# Altium schematic sheet STPedal_STM32.SchDoc
size A4; SheetNumber: 1; SheetTotal: 4
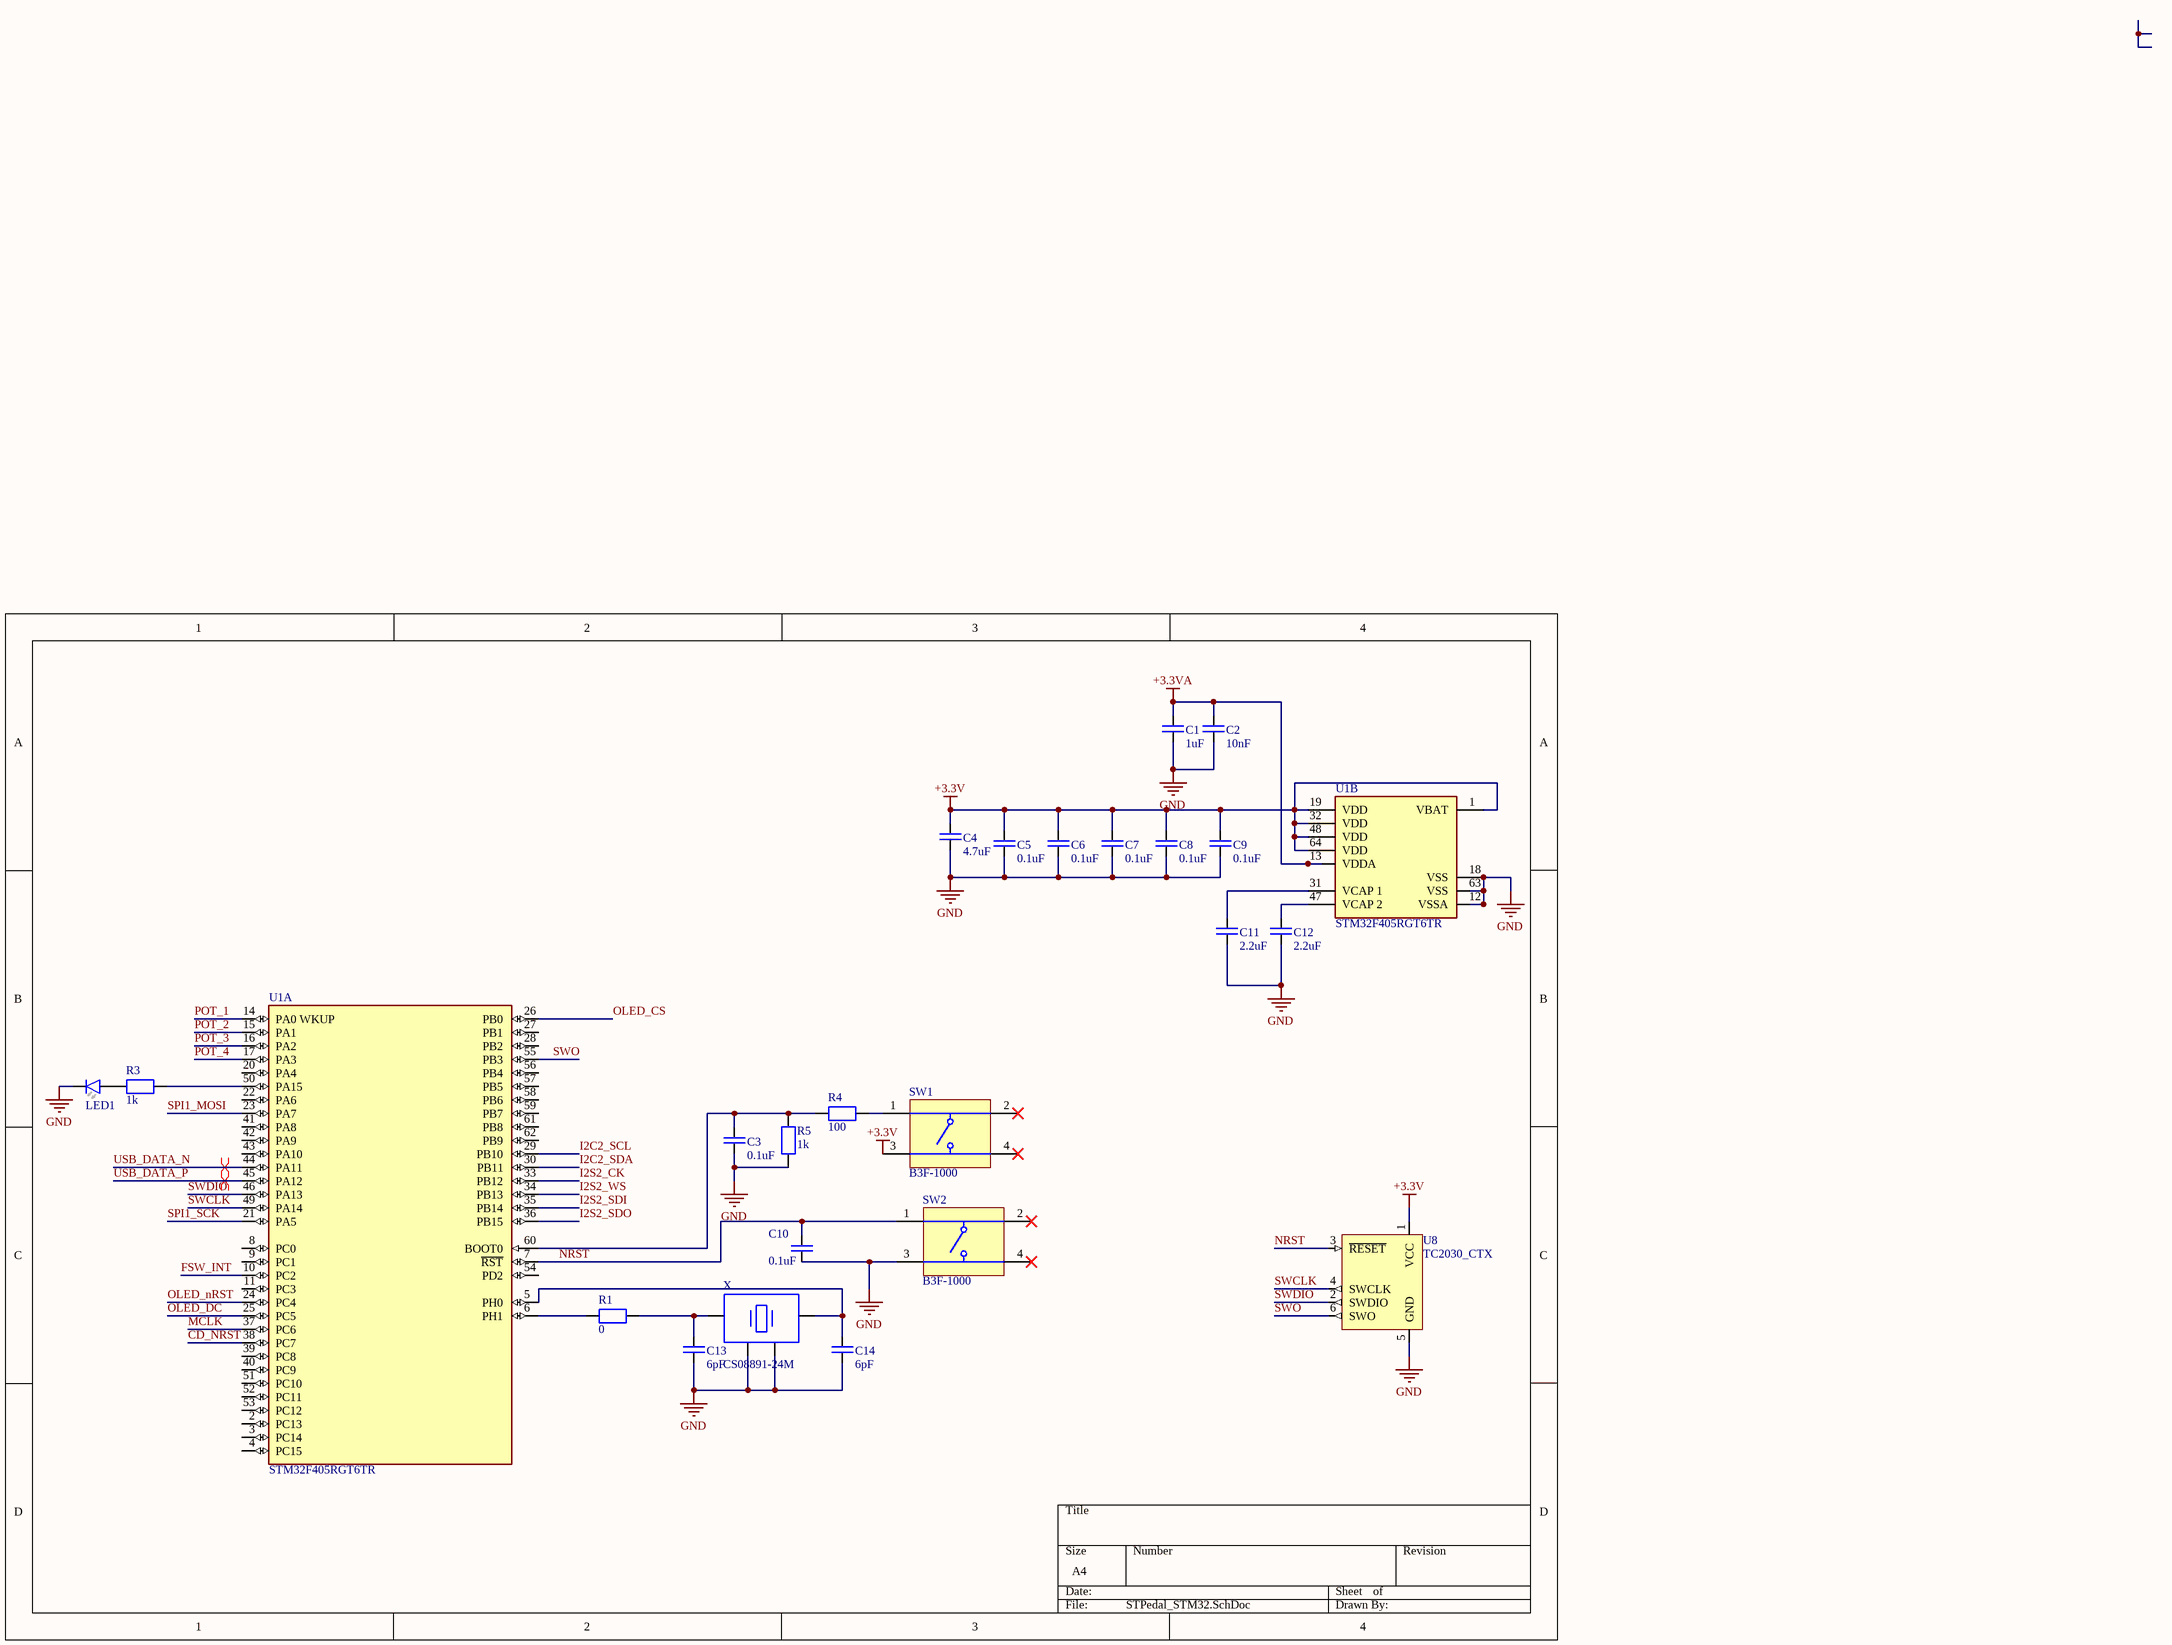
[diagram p0: STPedal_STM32.SchDoc]

## Parts
C1  1uF  [CAPC_0402_1005X55N]
C2  10nF  [CAPC_0402_1005X55N]
C3  0.1uF  [CAPC_0402_1005X55N]
C4  4.7uF  [CAPC_0402_1005X55N]
C5  0.1uF  [CAPC_0402_1005X55N]
C6  0.1uF  [CAPC_0402_1005X55N]
C7  0.1uF  [CAPC_0402_1005X55N]
C8  0.1uF  [CAPC_0402_1005X55N]
C9  0.1uF  [CAPC_0402_1005X55N]
C10  0.1uF  [CAPC_0402_1005X55N]
C11  2.2uF  [CAPC_0402_1005X55N]
C12  2.2uF  [CAPC_0402_1005X55N]
C13  6pF  [CAPC_0402_1005X55N]
C14  6pF  [CAPC_0402_1005X55N]
LED1  LED_White_JLCD_0603  [LED_0603_1608]  (value not drawn)
R1  0  [RESC_0402_1005X40N]
R3  1k  [RESC_0402_1005X40N]
R4  100  [RESC_0402_1005X40N]
R5  1k  [RESC_0402_1005X40N]
SW1  B3F-1000  [OMRON-B3F-1000-4_V]
SW2  B3F-1000  [OMRON-B3F-1000-4_V]
U1  STM32F405RGT6TR  [FP-LQFP64-5W-IPC_C]  (parts A,B of 2)
U8  TC2030_CTX  [TC2030_CTX]  (no BOM)
X  CS08891-24M  [4 SMD - No Lead]

## Nets
+3.3V: C4.2 C5.2 C6.2 C7.2 C8.2 C9.2 SW1.3 U1.1(VBAT) U1.19(VDD) U1.32(VDD) U1.48(VDD) U1.64(VDD) U8.1(VCC)
+3.3VA: C1.2 C2.2 U1.13(VDDA)
GND: C1.1 C2.1 C3.1 C4.1 C5.1 C6.1 C7.1 C8.1 C9.1 C10.1 C11.1 C12.1 C13.1 C14.1 LED1.2 R5.1 SW2.3 U1.12(VSSA) U1.18(VSS) U1.63(VSS) U8.5(GND) X.2 X.4
CD_NRST: U1.38(PC7)
FSW_INT: U1.10(PC2)
I2C2_SCL: U1.29(PB10)
I2C2_SDA: U1.30(PB11)
I2S2_CK: U1.33(PB12)
I2S2_SDI: U1.35(PB14)
I2S2_SDO: U1.36(PB15)
I2S2_WS: U1.34(PB13)
MCLK: U1.37(PC6)
NRST: C10.2 SW2.1 U1.7(~{RST}) U8.3(~{RESET})
OLED_CS: U1.26(PB0)
OLED_DC: U1.25(PC5)
OLED_nRST: U1.24(PC4)
POT_1: U1.14(PA0_WKUP)
POT_2: U1.15(PA1)
POT_3: U1.16(PA2)
POT_4: U1.17(PA3)
SPI1_MOSI: U1.23(PA7)
SPI1_SCK: U1.21(PA5)
SWCLK: U1.49(PA14) U8.4(SWCLK)
SWDIO: U1.46(PA13) U8.2(SWDIO)
SWO: U1.55(PB3) U8.6(SWO)
USB_DATA_N: U1.44(PA11)
USB_DATA_P: U1.45(PA12)
NetC3_2: C3.2 R4.1 R5.2 U1.60(BOOT0)
NetC11_2: C11.2 U1.31(VCAP_1)
NetC12_2: C12.2 U1.47(VCAP_2)
NetC13_2: C13.2 R1.2 X.1
NetC14_2: C14.2 U1.5(PH0) X.3
NetLED1_1: LED1.1 R3.1
NetR1_1: R1.1 U1.6(PH1)
NetR3_2: R3.2 U1.50(PA15)
NetR4_2: R4.2 SW1.1

Not connected (* = marked no-connect by the designer): SW1 2* 4*; SW2 2* 4*; U1 2(PC13) 3(PC14) 4(PC15) 8(PC0) 9(PC1) 11(PC3) 20(PA4) 22(PA6) 27(PB1) 28(PB2) 39(PC8) 40(PC9) 41(PA8) 42(PA9) 43(PA10) 51(PC10) 52(PC11) 53(PC12) 54(PD2) 56(PB4) 57(PB5) 58(PB6) 59(PB7) 61(PB8) 62(PB9)

## Layout directives
differential pair: USB_DATA_N, USB_DATA_P

## Library data of the parts
C1 = 1uF_CAP_0402: Capacitor 0402 - 1uF +-/10% / 25V; Manufacturer: Samsung Electro-Mechanics; MPN: CL05A105KA5NQNC; LCSC: C52923
C2 = 10nF_CAP_0402: Capacitor 0402 - 10nF +-/10% / 25V; Manufacturer: Samsung Electro-Mechanics; MPN: CL05B103KB5NNNC; LCSC: C15195
C3 C5-C10 = 0.1uF_CAP_0402: Capacitor 0402 - 0.1uF +-/10% / 16V; Manufacturer: Samsung Electro-Mechanics; MPN: CL05B104KO5NNNC; LCSC: C1525
C4 = 4.7uF_CAP_0402: Capacitor 0402 - 4.7uF +-/20% / 10V; Manufacturer: Samsung Electro-Mechanics; MPN: CL05A475MP5NRNC; LCSC: C23733
C11 C12 = 2.2uF_CAP_0402: Capacitor 0402 - 2.2uF +-/10% / 25V; Manufacturer: Samsung Electro-Mechanics; MPN: CL05A225MQ5NSNC; LCSC: C12530
C13 C14 = 6pF_CAP_0402: Capacitor 0402 - 6pF +-/10% / 50V - C0G; Manufacturer: FH (Guangdong Fenghua Advanced Tech); MPN: 0402CG6R0C500NT; LCSC: C1575
LED1 = LED_White_JLCD_0603: -40℃~+85℃ 100mW 120° 2.6V~3.1V 360mcd 5mA Discrete Diode Top-mount White Yellow Lens 0603 LED Indication - Discrete ROHS; Manufacturer: Hubei KENTO Elec; MPN: KT-0603W; LCSC: C2290
R1 = 0R_JLCRES-0402: -55℃~+155℃ 0Ω 50V 62.5mW Thick Film Resistor ±1% ±800ppm/℃ 0402 Chip Resistor - Surface Mount ROHS; Manufacturer: UNI-ROYAL(Uniroyal Elec); MPN: 0402WGF0000TCE; LCSC: C17168
R3 R5 = 1k_JLCRES-0402: Resistor 0402 - 1k; Manufacturer: UNI-ROYAL(Uniroyal Elec); MPN: 0402WGF1001TCE; LCSC: C11702
R4 = 100R_JLCRES-0402: Resistor 0402 - 100R; Manufacturer: *; MPN: *; LCSC: C25076
SW1 SW2 = CMP-011-00004-2: Tactile Switch, SPST-NO, 0.05 A, 24 V, -25 to 70 degC, 4-Pin THD, RoHS, Bulk; Manufacturer: Omron Electronic Components; Throw Configuration: SPST; Max Contact Resistance: 100mohm; Resistance: 0.1Ohm; Max Current Rating: 50mA; Voltage Rating: 24V; Operating Force: 100gf; Datasheet Version: Jan-15; Case/Package: B3F-1000; Packaging: Bulk; Package Description: 4-Pin Through Hole Device, Body 6 x 6 mm; Manufacturer URL: http://www.omron.com/; Package Reference: B3F-1000; Contact Plating: Gold; Contact Current Rating: 50mA; RoHS Compliant: True; Contact Material: Gold; Mounting Technology: TH; Max Operating Temperature: 70°C; Min Operating Temperature: -25°C; Package Quantity: 1500; Datasheet URL: http://www.omron.com/ecb/products/pdf/en-b3f.pdf; Voltage Rating (DC): 24V; Pins: 4; Current Rating: 50mA; Max Voltage Rating (DC): 24V
U1 = CMP-0243-00156-2: IC MCU 32BIT 1MB FLASH 64LQFP; Frequency: 168MHz; Number of SPI Channels: 3; Oscillator Type: Internal; Core Architecture: ARM; Number of UART Channels: 2; Max Supply Voltage: 3.6V; Watchdog Timer: Yes; RAM Size: 196KB; Interface: I2C; Max Power Dissipation: 435mW; Number of Timers/Counters: 14; Data Bus Width: 32b; Peripherals: Brown-out Detect/Reset; Number of ADC Channels: 16; Min Supply Voltage: 1.8V; Number of Programmable I/O: 51; Memory Size: 1024KB; Max Operating Temperature: 85°C; Package Quantity: 1000; Lead Free: Lead Free; Memory Type: FLASH; Case/Package: LQFP; Number of I2C Channels: 3; Contact Plating: Tin; Mount: Surface Mount; Min Operating Temperature: -40°C; Radiation Hardening: No; Number of USB Channels: 2; Packaging: Tape and Reel; Height: 1.45mm; Number of Pins: 64; Number of I/Os: 51; Max Frequency: 168MHz; Width: 10mm; Length: 10mm
X = CS08891-24M: CRYSTAL 24.0000MHZ 6PF SMD